# EAGLE design pyControl_devboard_1_2 (EAGLE 6.6.0)
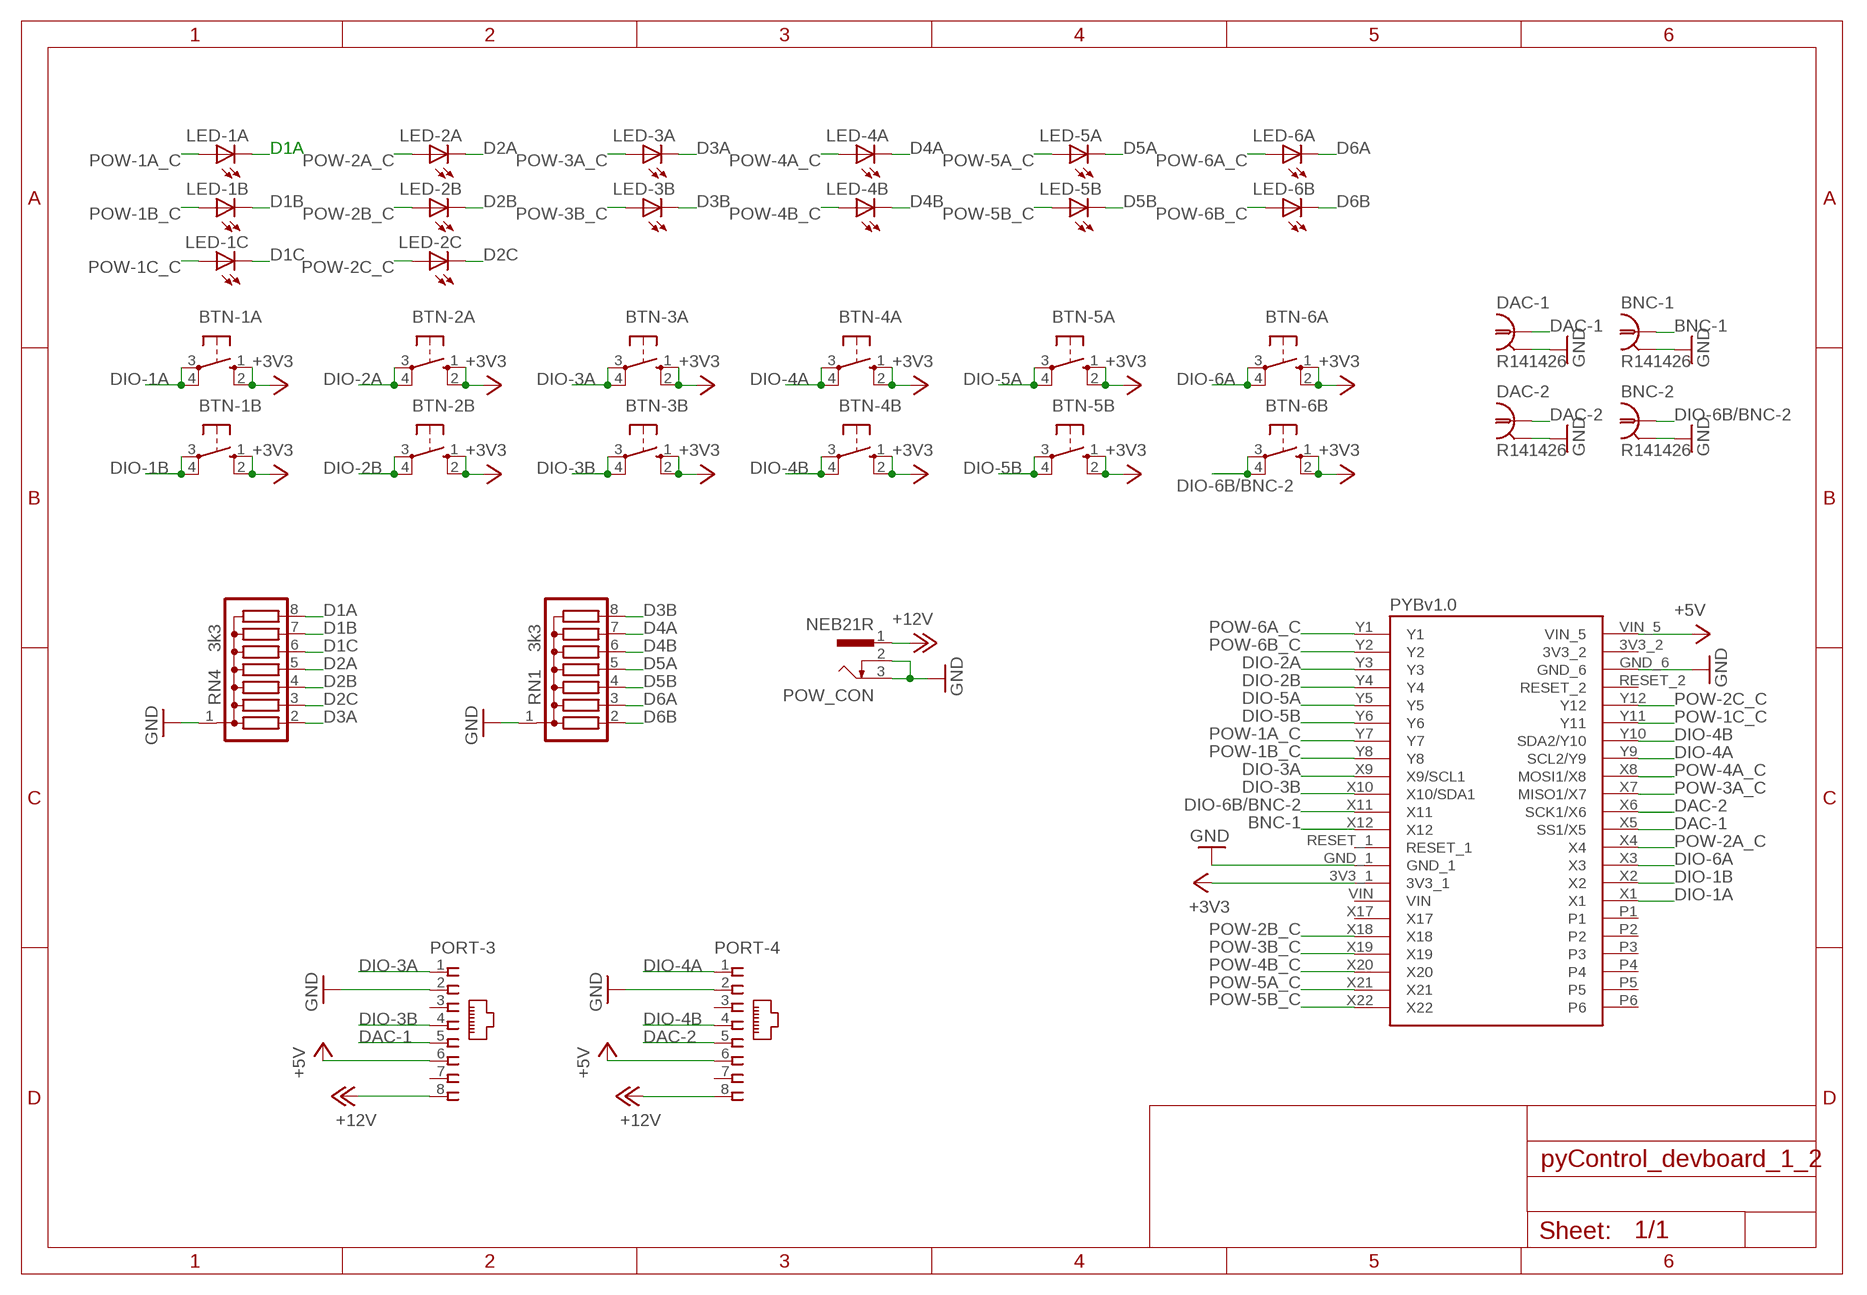
[diagram p0: schematic, sheet 1]

## Parts
BNC-1  R141426  [R141426]
BNC-2  R141426  [R141426]
BTN-1A  40-XX  [B3F-40XX]
BTN-1B  40-XX  [B3F-40XX]
BTN-2A  40-XX  [B3F-40XX]
BTN-2B  40-XX  [B3F-40XX]
BTN-3A  40-XX  [B3F-40XX]
BTN-3B  40-XX  [B3F-40XX]
BTN-4A  40-XX  [B3F-40XX]
BTN-4B  40-XX  [B3F-40XX]
BTN-5A  40-XX  [B3F-40XX]
BTN-5B  40-XX  [B3F-40XX]
BTN-6A  40-XX  [B3F-40XX]
BTN-6B  40-XX  [B3F-40XX]
DAC-1  R141426  [R141426]
DAC-2  R141426  [R141426]
LED-1A  LED3MM  [LED3MM]
LED-1B  LED3MM  [LED3MM]
LED-1C  LED3MM  [LED3MM]
LED-2A  LED3MM  [LED3MM]
LED-2B  LED3MM  [LED3MM]
LED-2C  LED3MM  [LED3MM]
LED-3A  LED3MM  [LED3MM]
LED-3B  LED3MM  [LED3MM]
LED-4A  LED3MM  [LED3MM]
LED-4B  LED3MM  [LED3MM]
LED-5A  LED3MM  [LED3MM]
LED-5B  LED3MM  [LED3MM]
LED-6A  LED3MM  [LED3MM]
LED-6B  LED3MM  [LED3MM]
PORT-3  RJ45VERTICAL  [RJ45-NO-SHIELD-VERTICAL]
PORT-4  RJ45VERTICAL  [RJ45-NO-SHIELD-VERTICAL]
POW_CON  NEB21R  [NEB21R]
PYBOARD  PYBOARD-REDUCED-2  [PYBOARD-REDUCED-2]
RN1  3k3  G07R  [SIL8]
RN4  3k3  G07R  [SIL8]

## Nets
+3V3: BTN-1A.1(S) BTN-1A.2(S1) BTN-1B.1(S) BTN-1B.2(S1) BTN-2A.1(S) BTN-2A.2(S1) BTN-2B.1(S) BTN-2B.2(S1) BTN-3A.1(S) BTN-3A.2(S1) BTN-3B.1(S) BTN-3B.2(S1) BTN-4A.1(S) BTN-4A.2(S1) BTN-4B.1(S) BTN-4B.2(S1) BTN-5A.1(S) BTN-5A.2(S1) BTN-5B.1(S) BTN-5B.2(S1) BTN-6A.1(S) BTN-6A.2(S1) BTN-6B.1(S) BTN-6B.2(S1) PYBOARD.3V3_1
+5V: PORT-3.6 PORT-4.6 PYBOARD.VIN_5
+12V: PORT-3.8 PORT-4.8 POW_CON.1
BNC-1: BNC-1.1 PYBOARD.X12
D1A: LED-1A.K(C) RN4.8
D1B: LED-1B.K(C) RN4.7
D1C: LED-1C.K(C) RN4.6
D2A: LED-2A.K(C) RN4.5
D2B: LED-2B.K(C) RN4.4
D2C: LED-2C.K(C) RN4.3
D3A: LED-3A.K(C) RN4.2
D3B: LED-3B.K(C) RN1.8
D4A: LED-4A.K(C) RN1.7
D4B: LED-4B.K(C) RN1.6
D5A: LED-5A.K(C) RN1.5
D5B: LED-5B.K(C) RN1.4
D6A: LED-6A.K(C) RN1.3
D6B: LED-6B.K(C) RN1.2
DAC-1: DAC-1.1 PORT-3.5 PYBOARD.X5(SS1/X5)
DAC-2: DAC-2.1 PORT-4.5 PYBOARD.X6(SCK1/X6)
DIO-1A: BTN-1A.3(P) BTN-1A.4(P1) PYBOARD.X1
DIO-1B: BTN-1B.3(P) BTN-1B.4(P1) PYBOARD.X2
DIO-2A: BTN-2A.3(P) BTN-2A.4(P1) PYBOARD.Y3
DIO-2B: BTN-2B.3(P) BTN-2B.4(P1) PYBOARD.Y4
DIO-3A: BTN-3A.3(P) BTN-3A.4(P1) PORT-3.1 PYBOARD.X9(X9/SCL1)
DIO-3B: BTN-3B.3(P) BTN-3B.4(P1) PORT-3.4 PYBOARD.X10(X10/SDA1)
DIO-4A: BTN-4A.3(P) BTN-4A.4(P1) PORT-4.1 PYBOARD.Y9(SCL2/Y9)
DIO-4B: BTN-4B.3(P) BTN-4B.4(P1) PORT-4.4 PYBOARD.Y10(SDA2/Y10)
DIO-5A: BTN-5A.3(P) BTN-5A.4(P1) PYBOARD.Y5
DIO-5B: BTN-5B.3(P) BTN-5B.4(P1) PYBOARD.Y6
DIO-6A: BTN-6A.3(P) BTN-6A.4(P1) PYBOARD.X3
DIO-6B/BNC-2: BNC-2.1 BTN-6B.3(P) BTN-6B.4(P1) PYBOARD.X11
GND: BNC-1.2(GND) BNC-2.2(GND) DAC-1.2(GND) DAC-2.2(GND) PORT-3.2 PORT-4.2 POW_CON.2 POW_CON.3 PYBOARD.GND_1 PYBOARD.GND_6 RN1.1 RN4.1
POW-1A_C: LED-1A.A PYBOARD.Y7
POW-1B_C: LED-1B.A PYBOARD.Y8
POW-1C_C: LED-1C.A PYBOARD.Y11
POW-2A_C: LED-2A.A PYBOARD.X4
POW-2B_C: LED-2B.A PYBOARD.X18
POW-2C_C: LED-2C.A PYBOARD.Y12
POW-3A_C: LED-3A.A PYBOARD.X7(MISO1/X7)
POW-3B_C: LED-3B.A PYBOARD.X19
POW-4A_C: LED-4A.A PYBOARD.X8(MOSI1/X8)
POW-4B_C: LED-4B.A PYBOARD.X20
POW-5A_C: LED-5A.A PYBOARD.X21
POW-5B_C: LED-5B.A PYBOARD.X22
POW-6A_C: LED-6A.A PYBOARD.Y1
POW-6B_C: LED-6B.A PYBOARD.Y2
Unconnected: PORT-3.3 PORT-3.7 PORT-4.3 PORT-4.7 PYBOARD.3V3_2 PYBOARD.P1 PYBOARD.P2 PYBOARD.P3 PYBOARD.P4 PYBOARD.P5 PYBOARD.P6 PYBOARD.RESET_1 PYBOARD.RESET_2 PYBOARD.VIN PYBOARD.X17

## Power pins joined to a net without a drawn wire
GND: BNC-1.3(GND) BNC-1.4(GND) BNC-1.5(GND) BNC-2.3(GND) BNC-2.4(GND) BNC-2.5(GND) DAC-1.3(GND) DAC-1.4(GND) DAC-1.5(GND) DAC-2.3(GND) DAC-2.4(GND) DAC-2.5(GND)

## Library data of the parts
BNC-1 BNC-2 DAC-1 DAC-2 = con-coax:R141426: BNC COAX CONNECTOR Radiall 50/75 Ohm Spoerle; MF: FARNELL; MPN: R141426161; OC_FARNELL: 4195115; OC_NEWARK: 14J7919
BTN-1A BTN-1B BTN-2A BTN-2B BTN-3A BTN-3B BTN-4A BTN-4B BTN-5A BTN-5B BTN-6A BTN-6B = switch-omron:40-XX: OMRON SWITCH; MF: OMRON COMPONENTS USA; MPN: B3F-4000; OC_FARNELL: 176434; OC_NEWARK: 36K3105
LED-1A LED-1B LED-1C LED-2A LED-2B LED-2C LED-3A LED-3B LED-4A LED-4B LED-5A LED-5B LED-6A LED-6B = led:LED: LED OSRAM: - CHIPLED LG R971, LG N971, LY N971, LG Q971, LY Q971, LO R971, LY R971 LH N974, LH R974 LS Q976, LO Q976, LY Q976 LO Q996 - Hyper CHIPLED LW Q18S LB Q993, LB Q99A, LB R99A - SideLED LS A670, LO A670, LY A670, LG A670, LP A670 LB A673, LV A673, LT A673, LW A673 LH A674 LY A675 LS A676, LA A676, LO A676, LY A676, LW A676 LS A679, LY A679, LG A679 - Hyper Micro SIDELED® LS Y876, LA Y876, LO Y876, LY Y876 LT Y87S - SmartLED LW L88C, LW L88S LB L89C, LB L89S, LG L890 LS L89K, LO L89K, LY L89K LS L896, LA L896, LO L896, LY L896 - TOPLED LS T670, LO T670, LY T670, LG T670, LP T670 LSG T670, LSP T670, LSY T670, LOP T670, LYG T670 LG T671, LOG T671, LSG T671 LB T673, LV T673, LT T673, LW T673 LH T674 LS T676, LA T676, LO T676, LY T676, LB T676, LH T676, LSB T676, LW T676 LB T67C, LV T67C, LT T67C, LS T67K, LO T67K, LY T67K, LW E67C LS E67B, LA E67B, LO E67B, LY E67B, LB E67C, LV E67C, LT E67C LW T67C LS T679, LY T679, LG T679 LS T770, LO T770, LY T770, LG T770, LP T770 LB T773, LV T773, LT T773, LW T773 LH T774 LS E675, LA E675, LY E675, LS T675 LS T776, LA T776, LO T776, LY T776, LB T776 LHGB T686 LT T68C, LB T68C - Hyper Mini TOPLED® LB M676 - Mini TOPLED Santana® LG M470 LS M47K, LO M47K, LY M47K Source: http://www.osram.convergy.de LUXEON: - LUMILED® LXK2-PW12-R00, LXK2-PW12-S00, LXK2-PW14-U00, LXK2-PW14-V00 LXK2-PM12-R00, LXK2-PM12-S00, LXK2-PM14-U00 LXK2-PE12-Q00, LXK2-PE12-R00, LXK2-PE12-S00, LXK2-PE14-T00, LXK2-PE14-U00 LXK2-PB12-K00, LXK2-PB12-L00, LXK2-PB12-M00, LXK2-PB14-N00, LXK2-PB14-P00, LXK2-PB14-Q00 LXK2-PR12-L00, LXK2-PR12-M00, LXK2-PR14-Q00, LXK2-PR14-R00 LXK2-PD12-Q00, LXK2-PD12-R00, LXK2-PD12-S00 LXK2-PH12-R00, LXK2-PH12-S00 LXK2-PL12-P00, LXK2-PL12-Q00, LXK2-PL12-R00 Source: www.luxeon.com KINGBRIGHT: KA-3528ASYC Source: www.kingbright.com
PORT-3 PORT-4 = con-tycoelectronics-vertical_RJ45:RJ45: CORCOM Modular RJ Jacks No Shield Source: www.tycoelectronics.com .. ENG_DS_1654001_1099_RJ_L_0507.pdf
POW_CON = con-lumberg:NEB21R: Netzgeräte-Einbaukupplung abgewinkelte Ausführung mit Öffner Source: http://www.lumberg.com/Produkte/PDFs/NEB21R.pdf; MPN: NEB 21 R; OC_FARNELL: 1217037; OC_NEWARK: 97K6458
PYBOARD = micropython:PYBOARD-REDUCED-2
RN1 RN4 = resistor-sil:G07R: SIL RESISTOR; OC_FARNELL: unknown; OC_NEWARK: unknown

## Board
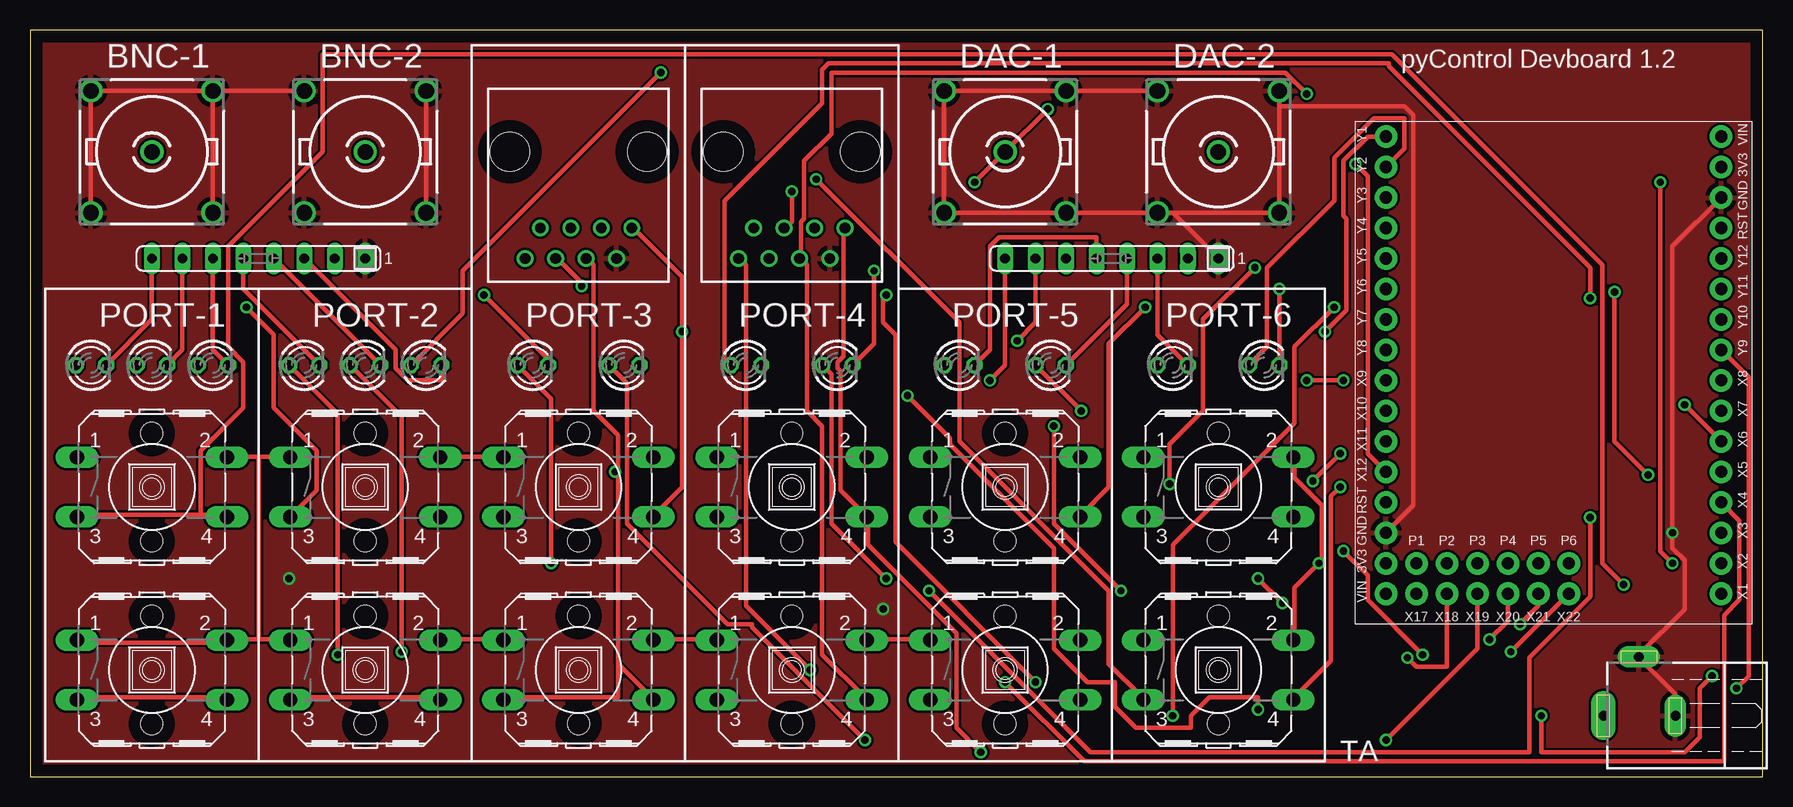
[diagram p1: board, top side]
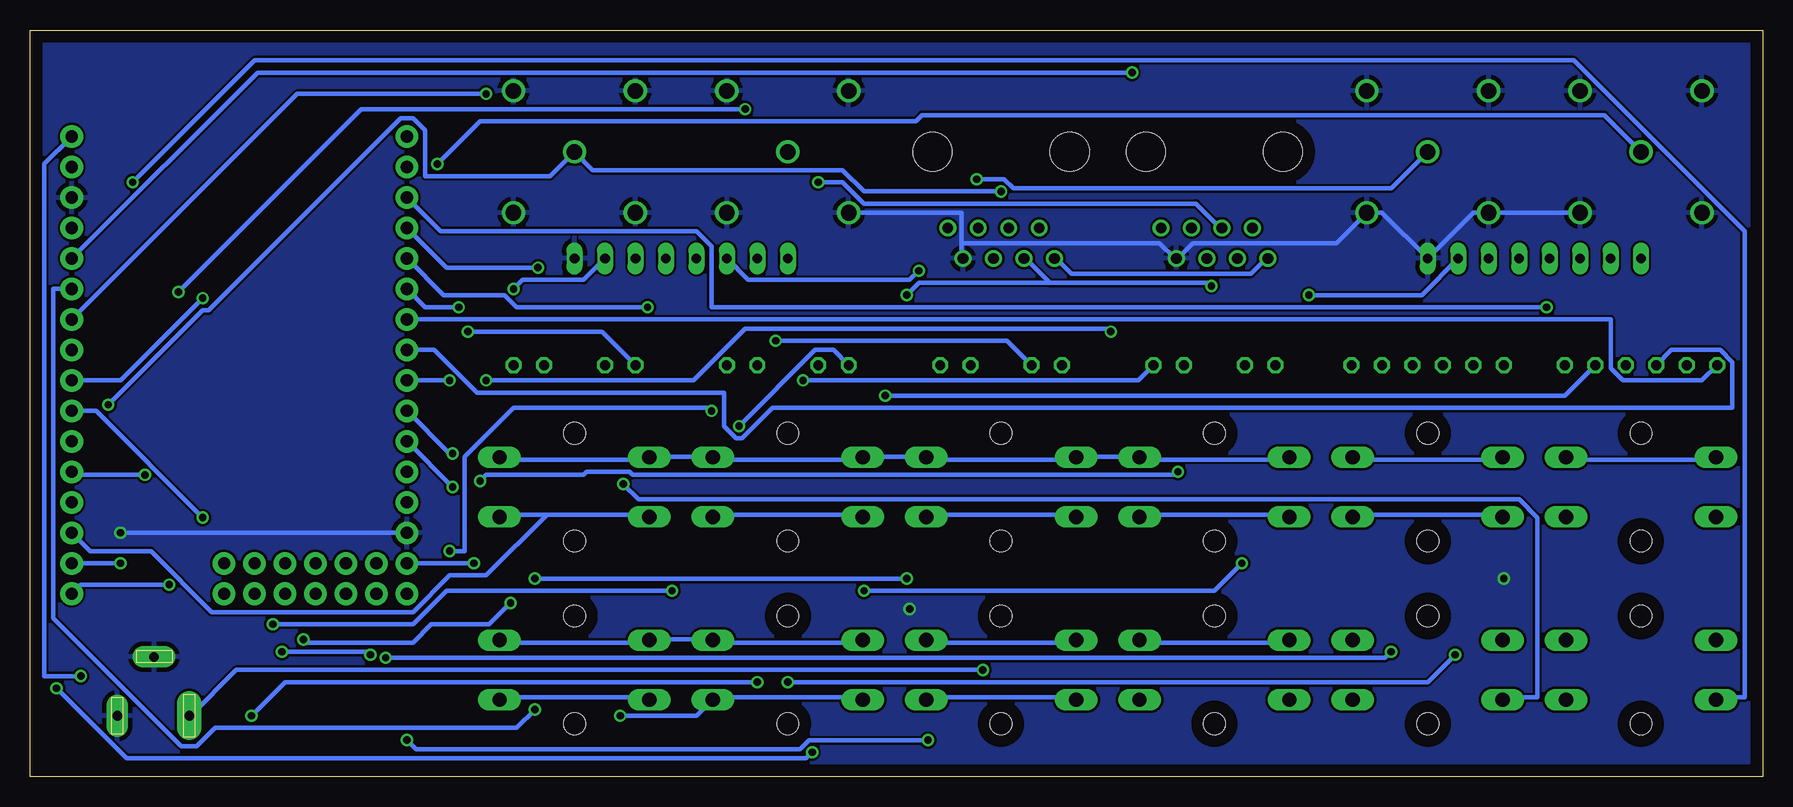
[diagram p2: board, bottom side, seen from below]

Size 144.45 x 62.22 mm. Coordinates in mm from the lower left corner, seen from the top.
Outline: 0,0 144.45,0 144.45,62.22 0,62.22 0,0
Copper layers (1*16): Top 0.035mm / dielectric 1.5mm / Bottom 0.035mm
Design rules "default": minimum track width 14mil, minimum drill 24mil, track to track 8mil, track to pad 8mil, pad to pad 8mil, via to via 8mil, smd to smd 8mil, copper to edge 40mil, drill to drill 8mil, minimum pad ring 10mil, minimum via ring 8mil, stop-mask expansion 4mil, vias tented up to drill 0mil, thermal gap 15mil
vRestrict: area 5.7,58.4 to 15.2,61.6; area 24.1,58.4 to 33,61.6; area 5.7,36.8 to 16.5,40; area 22.9,36.8 to 34.3,40; area 40.6,36.8 to 52.1,40; area 58.4,36.8 to 69.8,40; area 76.2,36.8 to 87.6,40; area 77.5,58.4 to 86.4,61.6; area 94.6,58.4 to 104.8,61.6; area 113,57.2 to 143.5,61.6; area 94.6,36.8 to 105.4,40

### Footprints (pad centres in the part's own frame; a part is rotated, then mirrored left to right if it is on the bottom)
R141426 = drill 1.295: 1 0,0; 2 5.08,5.08; 3 -5.08,5.08; 4 -5.08,-5.08; 5 5.08,-5.08
B3F-40XX = drill 1.194 long: 1 -6.248,2.489; 2 6.248,2.489; 3 -6.248,-2.489; 4 6.248,-2.489 | hole 1.803: 0,-4.496; 0,4.496
LED3MM = drill 0.813 octagon: A -1.27,0; K 1.27,0
RJ45-NO-SHIELD-VERTICAL = drill 0.9 pad 1.4: 1 -4.445,5.08; 2 -3.175,7.62; 3 -1.905,5.08; 4 -0.635,7.62; 5 0.635,5.08; 6 1.905,7.62; 7 3.175,5.08; 8 4.445,7.62 | hole 3.251: -5.715,-1.27; 5.715,-1.27
NEB21R = drill 0.813 pad 2.032 long: 1 0,7.35 | drill 0.813 pad 1.778 long: 2 4.9,4.4; 3 0,1.35
PYBOARD-REDUCED-2 = drill 1.016 pad 1.88: 3V3_1 2.54,5.08; 3V3_2 30.48,38.1; GND_1 2.54,7.62; GND_6 30.48,35.56; P1 5.08,5.08; P2 7.62,5.08; P3 10.16,5.08; P4 12.7,5.08; P5 15.24,5.08; P6 17.78,5.08; RESET_1 2.54,10.16; RESET_2 30.48,33.02; VIN 2.54,2.54; VIN_5 30.48,40.64; X1 30.48,2.54; X2 30.48,5.08; X3 30.48,7.62; X4 30.48,10.16; X5 30.48,12.7; X6 30.48,15.24; X7 30.48,17.78; X8 30.48,20.32; X9 2.54,20.32; X10 2.54,17.78; X11 2.54,15.24; X12 2.54,12.7; X17 5.08,2.54; X18 7.62,2.54; X19 10.16,2.54; X20 12.7,2.54; X21 15.24,2.54; X22 17.78,2.54; Y1 2.54,40.64; Y2 2.54,38.1; Y3 2.54,35.56; Y4 2.54,33.02; Y5 2.54,30.48; Y6 2.54,27.94; Y7 2.54,25.4; Y8 2.54,22.86; Y9 30.48,22.86; Y10 30.48,25.4; Y11 30.48,27.94; Y12 30.48,30.48
SIL8 = drill 0.813 long: 1 -8.89,0; 2 -6.35,0; 3 -3.81,0; 4 -1.27,0; 5 1.27,0; 6 3.81,0; 7 6.35,0; 8 8.89,0

### Placement (x,y rotation side)
BNC-1  10.16,52.07 0 top
BNC-2  27.94,52.07 0 top
BTN-1A  10.16,24.13 0 top
BTN-1B  10.16,8.89 0 top
BTN-2A  27.94,24.13 0 top
BTN-2B  27.94,8.89 0 top
BTN-3A  45.72,24.13 0 top
BTN-3B  45.72,8.89 0 top
BTN-4A  63.5,24.13 0 top
BTN-4B  63.5,8.89 0 top
BTN-5A  81.28,24.13 0 top
BTN-5B  81.28,8.89 0 top
BTN-6A  99.06,24.13 0 top
BTN-6B  99.06,8.89 0 top
DAC-1  81.28,52.07 0 top
DAC-2  99.06,52.07 0 top
LED-1A  5.08,34.29 0 top
LED-1B  10.16,34.29 0 top
LED-1C  15.24,34.29 0 top
LED-2A  22.86,34.29 0 top
LED-2B  27.94,34.29 0 top
LED-2C  33.02,34.29 0 top
LED-3A  41.91,34.29 0 top
LED-3B  49.53,34.29 0 top
LED-4A  59.69,34.29 0 top
LED-4B  67.31,34.29 0 top
LED-5A  77.47,34.29 0 top
LED-5B  85.09,34.29 0 top
LED-6A  95.25,34.29 0 top
LED-6B  102.87,34.29 0 top
PORT-3  45.72,50.8 180 top
PORT-4  63.5,50.8 180 top
POW_CON  138.51,5.08 90 top
PYBOARD  110.49,12.7 0 top
RN1  90.17,43.18 180 top
RN4  19.05,43.18 180 top

### Tracks (layer width: path | path; a pad name or v marks a point on that pad's centre or on a via)
+3V3  (via drill 0.61)
  Top 0.356: BTN-6B.2 105.41,11.43 105.41,15.75 v107.44,17.78 107.7,18.03 107.7,22.61 105.41,24.89 105.41,26.42 BTN-6A.2 | BTN-4B.2 69.85,11.43 74.93,11.43 BTN-5B.1 | BTN-2B.2 34.29,11.43 39.37,11.43 BTN-3B.1 | BTN-3B.2 52.07,11.43 57.15,11.43 BTN-4B.1 | BTN-1B.1 4.06,11.18 16.26,11.18 BTN-1B.2 16.51,11.43 19.05,11.43 | 19.05,11.43 21.59,11.43 BTN-2B.1 | BTN-2A.2 34.29,26.67 39.37,26.67 BTN-3A.1 | 19.05,26.67 16.51,26.67 BTN-1A.2 | 19.05,26.67 21.59,26.67 BTN-2A.1 | 19.05,26.67 19.05,11.43
  Bottom 0.356: BTN-6B.2 105.16,11.18 92.96,11.18 BTN-6B.1 92.71,11.43 87.63,11.43 BTN-5B.2 87.38,11.18 75.18,11.18 BTN-5B.1 | v107.44,17.78 PYBOARD.3V3_1 | BTN-3B.1 39.62,11.18 51.82,11.18 BTN-3B.2 | BTN-4B.2 69.6,11.18 57.4,11.18 BTN-4B.1 | BTN-6A.2 105.16,26.42 92.96,26.42 BTN-6A.1 92.71,26.67 87.63,26.67 BTN-5A.2 87.38,26.42 75.18,26.42 BTN-5A.1 74.93,26.67 69.85,26.67 BTN-4A.2 69.6,26.42 57.4,26.42 BTN-4A.1 57.15,26.67 52.07,26.67 BTN-3A.2 51.82,26.42 39.62,26.42 BTN-3A.1 | BTN-1A.1 4.06,26.42 16.26,26.42 BTN-1A.2 | BTN-2A.2 34.04,26.42 21.84,26.42 BTN-2A.1
+5V  (via drill 0.61)
  Top 0.356: v45.97,40.89 45.97,41.15 43.94,43.18 PORT-3.6 | v140.21,8.38 139.19,7.37 139.19,3.3 137.92,2.03 125.98,2.03 v125.98,5.08 | v83.82,7.87 72.14,19.56 72.14,36.83 71.12,37.85 71.12,39.88 v71.37,40.13
  Bottom 0.356: v45.97,40.89 46.23,41.15 59.44,41.15 | 59.44,41.15 61.47,43.18 PORT-4.6 | PYBOARD.VIN_5 143.26,51.05 143.26,8.38 v140.21,8.38 | v125.98,5.08 123.19,7.87 v83.82,7.87 | v71.37,40.13 70.36,41.15 59.44,41.15
+12V  (via drill 0.61)
  Top 0.356: v65.02,8.89 59.69,14.22 59.69,42.67 59.18,43.18 PORT-4.8
  Bottom 0.356: PORT-3.8 41.4,43.18 42.67,41.91 57.66,41.91 58.93,43.18 PORT-4.8 | v65.02,8.89 127.25,8.89 131.06,5.08 POW_CON.1
BNC-1  (via drill 0.61)
  Top 0.356: PYBOARD.X12 111.51,26.92 111.51,50.04 v110.49,51.05
  Bottom 0.356: v110.49,51.05 106.93,54.61 70.61,54.61 70.1,55.12 13.21,55.12 BNC-1.1
D1A
  Top 0.356: LED-1A.K 10.16,38.1 RN4.8
D1B
  Top 0.356: LED-1B.K 12.7,35.56 RN4.7
D1C
  Top 0.356: LED-1C.K 15.24,35.56 RN4.6
D2A
  Top 0.356: LED-2A.K 17.78,40.64 RN4.5
D2B
  Top 0.356: RN4.4 LED-2B.K
D2C
  Top 0.356: RN4.3 30.48,35.56 30.48,34.04 31.5,33.02 34.29,33.02 LED-2C.K
D3A  (via drill 0.61)
  Top 0.356: v37.85,40.13 43.18,34.8 LED-3A.K
  Bottom 0.356: RN4.2 28.45,40.13 v37.85,40.13
D3B  (via drill 0.61)
  Top 0.356: v80.01,33.02 81.28,34.29 RN1.8
  Bottom 0.356: LED-3B.K 52.07,33.02 v80.01,33.02
D4A  (via drill 0.61)
  Top 0.356: v82.3,36.32 83.82,37.85 RN1.7
  Bottom 0.356: LED-4A.K 62.99,36.32 v82.3,36.32
D4B  (via drill 0.61)
  Top 0.356: LED-4B.K 70.36,36.07 v70.36,42.16
  Bottom 0.356: v70.36,42.16 71.12,41.4 84.58,41.4 RN1.6
D5A
  Top 0.356: LED-5A.K 80.01,35.56 80.01,44.2 80.77,44.96 88.9,44.96 RN1.5
D5B
  Top 0.356: LED-5B.K 91.44,39.37 RN1.4
D6A
  Top 0.356: LED-6A.K 93.98,36.83 RN1.3
D6B  (via drill 0.61)
  Top 0.356: v104.14,40.64 LED-6B.K
  Bottom 0.356: v104.14,40.64 103.38,41.4 98.3,41.4 RN1.2
DAC-1  (via drill 0.61)
  Top 0.356: v78.74,49.53 DAC-1.1 v84.84,55.63 | v134.87,25.15 132.08,27.94 v132.08,40.39
  Bottom 0.356: v78.74,49.53 76.71,49.53 74.93,47.75 47.24,47.75 45.21,45.72 PORT-3.5 | PYBOARD.X5 140.72,25.15 v134.87,25.15 | v132.08,40.39 116.84,55.63 v84.84,55.63
DAC-2  (via drill 0.61)
  Top 0.356: v63.5,48.77 63.5,46.23 62.99,45.72 PORT-4.5 | v137.92,30.99 PYBOARD.X6
  Bottom 0.356: v63.5,48.77 74.93,48.77 76.71,50.55 97.54,50.55 DAC-2.1 101.09,50.04 111.51,50.04 111.51,53.85 112.52,54.86 113.54,54.86 129.54,38.86 130.05,38.86 v137.92,30.99
DIO-1A  (via drill 0.61)
  Top 0.356: 14.22,21.84 16.26,21.84 BTN-1A.4 | 14.22,21.84 4.06,21.84 BTN-1A.3 | v132.84,16 131.06,17.78 131.06,42.67 113.54,60.2 24.38,60.2 24.38,52.07 16.51,44.2 16.51,35.81 17.78,34.54 17.78,30.73 14.22,27.18 14.22,21.84
  Bottom 0.356: PYBOARD.X1 140.21,16 v132.84,16
DIO-1B  (via drill 0.61)
  Top 0.356: BTN-1B.3 4.06,6.6 16.26,6.6 BTN-1B.4 | v136.91,17.78 135.89,18.8 v135.89,49.53
  Bottom 0.356: v136.91,17.78 PYBOARD.X2 | v135.89,49.53 125.73,59.69 15.75,59.69 1.52,45.47 1.52,6.6 3.81,6.6 BTN-1B.3
DIO-2A  (via drill 0.61)
  Top 0.356: v18.03,39.12 20.32,36.83 20.32,30.73 23.88,27.18 23.88,23.88 21.84,21.84 BTN-2A.3
  Bottom 0.356: BTN-2A.3 21.84,21.84 34.04,21.84 BTN-2A.4 | PYBOARD.Y3 110.24,45.47 88.9,45.47 87.63,44.2 87.63,39.12 v18.03,39.12
DIO-2B  (via drill 0.61)
  Top 0.356: BTN-2B.3 21.84,6.6 34.04,6.6 BTN-2B.4 | v102.11,42.42 97.79,38.1 97.79,30.48 95,27.69 v95,24.38
  Bottom 0.356: PYBOARD.Y4 109.73,42.42 v102.11,42.42 | v95,24.38 93.73,23.11 20.32,23.11 18.8,21.59 18.8,6.6 21.59,6.6 BTN-2B.3
DIO-3A  (via drill 0.61)
  Top 0.356: PORT-3.1 50.29,45.72 54.36,41.66 v54.36,37.08 54.36,24.13 52.07,21.84 BTN-3A.4 | v106.43,33.02 v109.47,33.02
  Bottom 0.356: BTN-3A.3 39.62,21.84 51.82,21.84 BTN-3A.4 | v109.47,33.02 PYBOARD.X9 | v106.43,33.02 89.15,33.02 84.84,37.34 54.61,37.34 v54.36,37.08
DIO-3B  (via drill 0.61)
  Top 0.356: 49.02,9.4 49.02,25.4 | 49.02,25.4 49.02,28.45 46.99,30.48 46.99,42.67 46.48,43.18 PORT-3.4 | 49.02,9.4 51.82,6.6 BTN-3B.4 | 49.02,9.4 49.02,6.6 39.62,6.6 BTN-3B.3 | v106.93,24.64 v109.22,26.92 | 49.02,25.4 v48.77,25.4
  Bottom 0.356: PYBOARD.X10 109.47,26.92 v109.22,26.92 | v106.93,24.64 106.43,25.15 98.3,25.15 98.04,25.4 94.49,25.4 94.23,25.15 49.02,25.15 v48.77,25.4
DIO-4A  (via drill 0.61)
  Top 0.356: PORT-4.1 67.82,45.72 67.82,35.05 67.31,34.54 67.31,34.04 67.56,33.78 67.56,23.88 69.6,21.84 BTN-4A.4 69.85,21.59 69.85,19.3 77.22,11.94 77.22,4.06 v79.25,2.03 | PYBOARD.Y9 143.26,33.27 143.26,8.38 v142.24,7.37
  Bottom 0.356: BTN-4A.3 57.4,21.84 69.6,21.84 BTN-4A.4 | v142.24,7.37 136.4,1.52 79.76,1.52 v79.25,2.03
DIO-4B  (via drill 0.61)
  Top 0.356: 64.26,43.18 64.77,42.67 64.77,30.48 66.04,29.21 66.04,10.16 69.6,6.6 BTN-4B.4 | 64.26,43.18 PORT-4.4 64.26,43.18 | v106.43,56.9 104.65,58.67 66.8,58.67 66.8,53.59 64.52,51.31 64.52,46.48 64.26,46.23 64.26,43.18
  Bottom 0.356: BTN-4B.3 57.4,6.6 69.6,6.6 BTN-4B.4 | PYBOARD.Y10 122.17,56.9 v106.43,56.9
DIO-5A  (via drill 0.61)
  Top 0.356: v92.96,39.12 89.92,36.07 89.92,24.13 87.63,21.84 BTN-5A.4
  Bottom 0.356: BTN-5A.3 75.18,21.84 87.38,21.84 BTN-5A.4 | PYBOARD.Y5 109.98,40.13 104.9,40.13 103.89,39.12 v92.96,39.12
DIO-5B  (via drill 0.61)
  Top 0.356: v108.71,39.12 105.41,35.81 105.41,29.46 95.25,19.3 v95.25,5.08
  Bottom 0.356: BTN-5B.3 75.18,6.6 87.38,6.6 BTN-5B.4 87.63,6.35 88.9,5.08 v95.25,5.08 | PYBOARD.Y6 111.51,39.12 v108.71,39.12
DIO-6A
  Bottom 0.356: 101.35,21.84 105.16,21.84 BTN-6A.4 | 101.35,21.84 92.96,21.84 BTN-6A.3 | PYBOARD.X3 139.45,18.8 134.37,18.8 129.29,13.72 112.52,13.72 109.47,16.76 106.43,16.76 101.35,21.84
DIO-6B/BNC-2  (via drill 0.61)
  Top 0.356: v109.22,24.13 108.46,23.37 108.46,9.65 105.41,6.6 BTN-6B.4 | v65.53,49.78 77.47,37.85 77.47,27.94 89.92,15.49 89.92,9.4 92.71,6.6 BTN-6B.3
  Bottom 0.356: BTN-6B.3 92.96,6.6 105.16,6.6 BTN-6B.4 | v109.22,24.13 PYBOARD.X11 | BNC-2.1 30.99,49.02 62.48,49.02 63.25,49.78 v65.53,49.78
GND  (via drill 0.6, 0.61)
  Top 0.356: BNC-2.3 BNC-1.2 | BNC-1.4 BNC-1.3 BNC-1.2 | BNC-2.5 BNC-2.2 | BNC-1.5 BNC-1.2 | POW_CON.3 137.16,6.86 134.11,9.91 POW_CON.2 134.11,10.16 137.92,13.97 137.92,18.03 136.91,19.05 v136.91,20.32 136.91,44.2 PYBOARD.GND_6 | DAC-2.3 DAC-1.2 DAC-1.3 DAC-1.4 DAC-1.5 DAC-2.4 95.25,46.99 | 95.25,46.99 RN1.1 | 95.25,46.99 DAC-2.5 104.14,55.88 | PYBOARD.GND_1 115.32,22.61 115.32,55.12 114.55,55.88 104.14,55.88 | DAC-2.2 104.14,55.88
  Bottom 0.356: BNC-1.5 BNC-2.4 24.13,46.99 RN4.1 31.75,46.99 BNC-2.5 35.56,44.45 47.5,44.45 48.77,43.18 PORT-3.2 49.02,43.18 50.29,44.45 66.8,44.45 | 66.8,44.45 66.8,46.99 DAC-1.4 | 66.8,44.45 66.8,43.18 PORT-4.2 | PYBOARD.GND_1 v136.91,20.32
  other vias: 21.59,16.51 71.12,13.97
  pour Bottom: 0,0 0,62.23 144.78,62.23 144.78,0
  pour Top: 0,0 0,62.23 144.78,62.23 144.78,0
POW-1A_C
  Bottom 0.356: LED-1A.A 5.08,33.02 11.68,33.02 12.7,34.04 12.7,38.1 PYBOARD.Y7
POW-1B_C
  Bottom 0.356: LED-1B.A 7.62,35.56 3.56,35.56 2.54,34.54 2.54,30.73 82.55,30.73 85.09,28.19 85.6,28.19 86.61,29.21 86.61,32 107.19,32 110.74,35.56 PYBOARD.Y8
POW-1C_C  (via drill 0.61)
  Top 0.356: v73.15,31.75 76.71,28.19 76.71,27.69 85.34,19.05 85.34,10.67 88.14,7.87 90.42,7.87 90.42,5.84 92.2,4.06 96.77,4.06 96.77,5.08 98.3,6.6 102.36,6.6 v102.36,5.59
  Bottom 0.356: LED-1C.A 16.51,31.75 v73.15,31.75 | v102.36,5.59 103.89,4.06 129.03,4.06 130.56,2.54 131.83,2.54 142.49,13.21 142.49,40.64 PYBOARD.Y11
POW-2A_C  (via drill 0.61)
  Top 0.356: LED-2A.A 25.65,30.23 v25.65,10.16 | v81.28,7.87 87.88,1.27 141.22,1.27 141.22,13.46 142.49,14.73 142.49,21.34 PYBOARD.X4
  Bottom 0.356: v25.65,10.16 27.94,7.87 v81.28,7.87
POW-2B_C  (via drill 0.61)
  Top 0.356: LED-2B.A 30.99,29.97 v30.99,10.41 | v114.81,9.91 115.57,9.14 118.11,9.14 PYBOARD.X18
  Bottom 0.356: v30.99,10.41 31.5,9.91 v114.81,9.91
POW-2C_C  (via drill 0.61)
  Top 0.356: LED-2C.A 36.07,38.61 36.07,42.16 v52.58,58.67
  Bottom 0.356: v52.58,58.67 125.48,58.67 PYBOARD.Y12
POW-3A_C  (via drill 0.61)
  Top 0.356: LED-3A.A 43.43,31.5 v43.43,17.78 | v74.93,15.49 88.39,2.03 124.97,2.03 124.97,9.91 130.05,14.99 v130.05,21.59
  Bottom 0.356: v43.43,17.78 45.72,15.49 v74.93,15.49 | v130.05,21.59 138.94,30.48 PYBOARD.X7
POW-3B_C  (via drill 0.61)
  Top 0.356: LED-3B.A 49.78,32.77 49.78,21.08 58.17,12.7 60.2,12.7 60.2,12.45 v69.6,3.05 | v113.03,3.05 120.65,10.67 PYBOARD.X19
  Bottom 0.356: v69.6,3.05 79.5,3.05 80.26,2.29 112.27,2.29 v113.03,3.05
POW-4A_C  (via drill 0.61)
  Top 0.356: LED-4A.A 57.91,34.8 57.91,48.01 66.04,56.13 66.04,58.93 66.55,59.44 113.28,59.44 113.28,59.18 130.05,42.42 v130.05,39.88
  Bottom 0.356: v130.05,39.88 136.91,33.02 PYBOARD.X8
POW-4B_C  (via drill 0.61)
  Top 0.356: LED-4B.A 66.8,33.53 66.8,21.08 v71.37,16.51 | v104.39,14.48 v102.36,16.51 | v121.67,11.43 123.19,12.95 PYBOARD.X20
  Bottom 0.356: v102.36,16.51 v71.37,16.51 | v104.39,14.48 106.17,12.7 111,12.7 112.52,11.18 121.41,11.18 v121.67,11.43
POW-5A_C  (via drill 0.61)
  Top 0.356: v85.34,29.21 85.34,21.08 v90.93,15.49 | v124.21,12.7 125.73,14.22 PYBOARD.X21
  Bottom 0.356: LED-5A.A 77.47,35.56 78.99,35.56 v85.34,29.21 | v90.93,15.49 109.73,15.49 112.52,12.7 v124.21,12.7
POW-5B_C  (via drill 0.61)
  Top 0.356: v87.63,30.48 LED-5B.A | v109.47,18.8 111.51,16.76 111.51,14.73 v116.08,10.16 | PYBOARD.X22 v123.44,10.41
  Bottom 0.356: v87.63,30.48 87.88,30.73 104.14,30.73 108.2,26.67 108.2,18.8 v109.47,18.8 | v116.08,10.16 116.33,10.41 v123.44,10.41
POW-6A_C  (via drill 0.61)
  Top 0.356: v107.95,37.08 109.73,38.86 109.73,46.48 109.47,46.74 109.47,51.31 111.51,53.34 PYBOARD.Y1
  Bottom 0.356: LED-6A.A 96.77,37.08 v107.95,37.08
POW-6B_C
  Top 0.356: LED-6B.A 103.12,35.81 103.12,42.42 108.71,48.01 108.71,51.56 112.01,54.86 114.55,54.86 114.55,52.32 PYBOARD.Y2

### Text on the board
tNames: pyControl Devboard 1.2 | PORT-1 | PORT-2 | PORT-3 | PORT-4 | PORT-5 | PORT-6 | TA